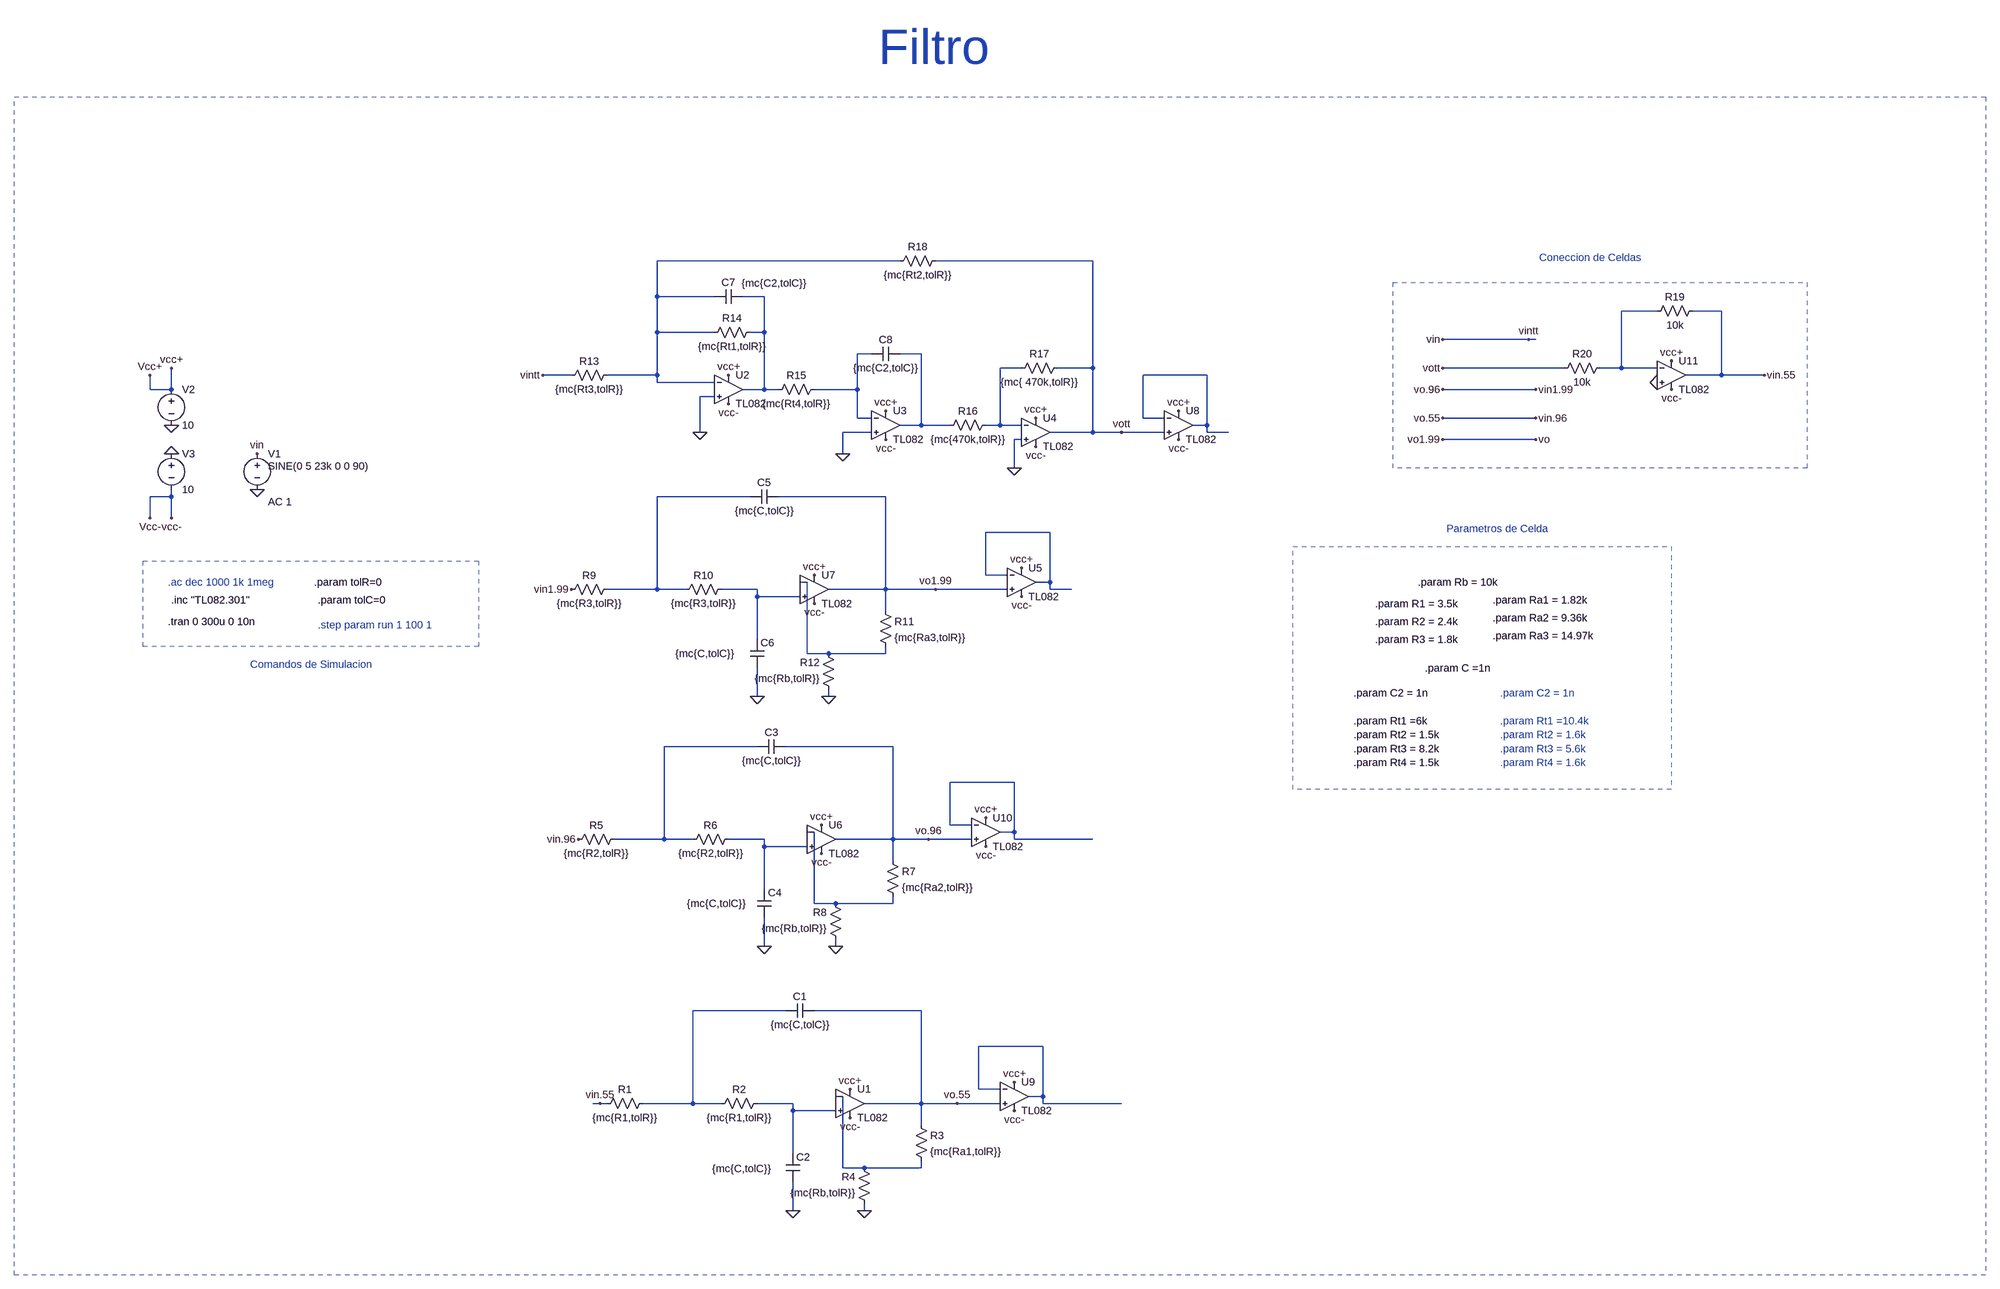
[diagram p0: schematic filterAux.asc]
filterAux.asc, the LTspice schematic file:
Version 4
SHEET 1 2724 1572
WIRE 288 -704 -256 -704
WIRE 720 -704 368 -704
WIRE -256 -624 -256 -704
WIRE -128 -624 -256 -624
WIRE -16 -624 -64 -624
WIRE 1984 -592 1904 -592
WIRE 2128 -592 2064 -592
WIRE -256 -544 -256 -624
WIRE -128 -544 -256 -544
WIRE -16 -544 -16 -624
WIRE -16 -544 -48 -544
WIRE 1696 -528 1504 -528
WIRE 1712 -528 1696 -528
WIRE 224 -496 192 -496
WIRE 336 -496 288 -496
WIRE 560 -464 512 -464
WIRE 720 -464 720 -704
WIRE 720 -464 640 -464
WIRE 1776 -464 1504 -464
WIRE 1904 -464 1904 -592
WIRE 1904 -464 1856 -464
WIRE 1984 -464 1904 -464
WIRE -448 -448 -512 -448
WIRE -256 -448 -256 -544
WIRE -256 -448 -368 -448
WIRE 976 -448 832 -448
WIRE 2128 -448 2128 -592
WIRE 2128 -448 2048 -448
WIRE 2224 -448 2128 -448
WIRE -256 -432 -256 -448
WIRE -128 -432 -256 -432
WIRE -1392 -416 -1392 -448
WIRE -1344 -416 -1344 -464
WIRE -1344 -416 -1392 -416
WIRE -16 -416 -16 -544
WIRE -16 -416 -64 -416
WIRE 16 -416 -16 -416
WIRE 192 -416 192 -496
WIRE 192 -416 96 -416
WIRE 1712 -416 1504 -416
WIRE -128 -400 -160 -400
WIRE 192 -352 192 -416
WIRE 224 -352 192 -352
WIRE 832 -352 832 -448
WIRE 880 -352 832 -352
WIRE 1712 -352 1504 -352
WIRE 336 -336 336 -496
WIRE 336 -336 288 -336
WIRE 400 -336 336 -336
WIRE 512 -336 512 -464
WIRE 512 -336 480 -336
WIRE 560 -336 512 -336
WIRE 976 -336 976 -448
WIRE 976 -336 944 -336
WIRE -160 -320 -160 -400
WIRE 224 -320 160 -320
WIRE 720 -320 720 -464
WIRE 720 -320 624 -320
WIRE 784 -320 720 -320
WIRE 880 -320 784 -320
WIRE 976 -320 976 -336
WIRE 1024 -320 976 -320
WIRE 560 -304 544 -304
WIRE 1712 -304 1504 -304
WIRE 160 -272 160 -320
WIRE 544 -240 544 -304
WIRE -1344 -176 -1344 -192
WIRE -1344 -176 -1392 -176
WIRE -48 -176 -256 -176
WIRE 256 -176 16 -176
WIRE -1392 -128 -1392 -176
WIRE -1344 -128 -1344 -176
WIRE 624 -96 480 -96
WIRE 480 0 480 -96
WIRE 528 0 480 0
WIRE 80 16 64 16
WIRE 624 16 624 -96
WIRE 624 16 592 16
WIRE -256 32 -256 -176
WIRE -256 32 -368 32
WIRE -192 32 -256 32
WIRE -32 32 -112 32
WIRE 256 32 256 -176
WIRE 256 32 128 32
WIRE 368 32 256 32
WIRE 528 32 368 32
WIRE 624 32 624 16
WIRE 672 32 624 32
WIRE -32 48 -32 32
WIRE 64 48 -32 48
WIRE 256 80 256 32
WIRE -32 144 -32 48
WIRE 80 176 80 16
WIRE 128 176 80 176
WIRE 256 176 256 160
WIRE 256 176 128 176
WIRE -32 272 -32 208
WIRE 128 272 128 256
WIRE -32 384 -240 384
WIRE 272 384 32 384
WIRE 544 464 400 464
WIRE 400 560 400 464
WIRE 448 560 400 560
WIRE 96 576 80 576
WIRE 544 576 544 464
WIRE 544 576 512 576
WIRE -240 592 -240 384
WIRE -240 592 -352 592
WIRE -176 592 -240 592
WIRE -16 592 -96 592
WIRE 272 592 272 384
WIRE 272 592 144 592
WIRE 352 592 272 592
WIRE 448 592 352 592
WIRE 544 592 544 576
WIRE 720 592 544 592
WIRE -16 608 -16 592
WIRE 80 608 -16 608
WIRE 272 640 272 592
WIRE -16 704 -16 608
WIRE 96 736 96 576
WIRE 144 736 96 736
WIRE 272 736 272 720
WIRE 272 736 144 736
WIRE -16 832 -16 768
WIRE 144 832 144 816
WIRE 32 976 -176 976
WIRE 336 976 96 976
WIRE 608 1056 464 1056
WIRE 464 1152 464 1056
WIRE 512 1152 464 1152
WIRE 160 1168 144 1168
WIRE 608 1168 608 1056
WIRE 608 1168 576 1168
WIRE -384 1184 -400 1184
WIRE -368 1184 -384 1184
WIRE -176 1184 -176 976
WIRE -176 1184 -288 1184
WIRE -112 1184 -176 1184
WIRE 48 1184 -32 1184
WIRE 336 1184 336 976
WIRE 336 1184 208 1184
WIRE 416 1184 336 1184
WIRE 512 1184 416 1184
WIRE 608 1184 608 1168
WIRE 784 1184 608 1184
WIRE 48 1200 48 1184
WIRE 144 1200 48 1200
WIRE 336 1232 336 1184
WIRE 48 1296 48 1200
WIRE 160 1328 160 1168
WIRE 208 1328 160 1328
WIRE 336 1328 336 1312
WIRE 336 1328 208 1328
WIRE 48 1424 48 1360
WIRE 208 1424 208 1408
FLAG -1152 -192 0
FLAG -1344 -336 0
FLAG -1344 -272 0
FLAG -1344 -464 vcc+
FLAG -1344 -128 vcc-
FLAG -1152 -272 vin
FLAG 48 1424 0
FLAG 208 1424 0
FLAG 176 1152 vcc+
FLAG 176 1216 vcc-
FLAG -16 832 0
FLAG 144 832 0
FLAG -32 272 0
FLAG 128 272 0
FLAG -96 -448 vcc+
FLAG -96 -384 vcc-
FLAG 256 -368 vcc+
FLAG 256 -304 vcc-
FLAG 592 -352 vcc+
FLAG 592 -288 vcc-
FLAG 368 32 vo1.99
FLAG -160 -320 0
FLAG 160 -272 0
FLAG 544 -240 0
FLAG 560 -16 vcc+
FLAG 560 48 vcc-
FLAG 112 560 vcc+
FLAG 112 624 vcc-
FLAG 96 0 vcc+
FLAG 96 64 vcc-
FLAG 912 -368 vcc+
FLAG 912 -304 vcc-
FLAG -512 -448 vintt
FLAG 544 1136 vcc+
FLAG 544 1200 vcc-
FLAG 480 544 vcc+
FLAG 480 608 vcc-
FLAG 784 -320 vott
FLAG -448 32 vin1.99
FLAG -432 592 vin.96
FLAG 352 592 vo.96
FLAG -384 1184 vin.55
FLAG 416 1184 vo.55
FLAG 1504 -528 vin
FLAG 1696 -528 vintt
FLAG 1504 -464 vott
FLAG 1712 -352 vin.96
FLAG 2224 -448 vin.55
FLAG 1504 -416 vo.96
FLAG 1712 -416 vin1.99
FLAG 1504 -352 vo.55
FLAG 1504 -304 vo1.99
FLAG 1712 -304 vo
FLAG 2016 -480 vcc+
FLAG 2016 -416 vcc-
FLAG 1984 -432 0
FLAG -1392 -448 Vcc+
FLAG -1392 -128 Vcc-
SYMBOL voltage -1152 -288 R0
WINDOW 123 24 124 Left 2
WINDOW 39 0 0 Left 2
WINDOW 3 24 44 Left 2
SYMATTR Value2 AC 1
SYMATTR Value SINE(0 5 23k 0 0 90)
SYMATTR InstName V1
SYMBOL voltage -1344 -432 R0
WINDOW 123 0 0 Left 0
WINDOW 39 0 0 Left 0
SYMATTR InstName V2
SYMATTR Value 10
SYMBOL voltage -1344 -288 R0
WINDOW 123 0 0 Left 0
WINDOW 39 0 0 Left 0
SYMATTR InstName V3
SYMATTR Value 10
SYMBOL res -272 1168 R90
WINDOW 0 0 56 VBottom 2
WINDOW 3 32 56 VTop 2
SYMATTR InstName R1
SYMATTR Value {mc{R1,tolR}}
SYMBOL res -16 1168 R90
WINDOW 0 0 56 VBottom 2
WINDOW 3 32 56 VTop 2
SYMATTR InstName R2
SYMATTR Value {mc{R1,tolR}}
SYMBOL Opamps\\opamp2 176 1120 R0
SYMATTR InstName U1
SYMATTR Value TL082
SYMBOL cap 96 960 R90
WINDOW 0 0 32 VBottom 2
WINDOW 3 32 32 VTop 2
SYMATTR InstName C1
SYMATTR Value {mc{C,tolC}}
SYMBOL cap 32 1296 R0
WINDOW 3 -165 34 Left 2
SYMATTR Value {mc{C,tolC}}
SYMATTR InstName C2
SYMBOL res 320 1216 R0
SYMATTR InstName R3
SYMATTR Value {mc{Ra1,tolR}}
SYMBOL res 224 1424 R180
WINDOW 0 36 76 Left 2
WINDOW 3 36 40 Left 2
SYMATTR InstName R4
SYMATTR Value {mc{Rb,tolR}}
SYMBOL res -336 576 R90
WINDOW 0 0 56 VBottom 2
WINDOW 3 32 56 VTop 2
SYMATTR InstName R5
SYMATTR Value {mc{R2,tolR}}
SYMBOL res -80 576 R90
WINDOW 0 0 56 VBottom 2
WINDOW 3 32 56 VTop 2
SYMATTR InstName R6
SYMATTR Value {mc{R2,tolR}}
SYMBOL cap 32 368 R90
WINDOW 0 0 32 VBottom 2
WINDOW 3 32 32 VTop 2
SYMATTR InstName C3
SYMATTR Value {mc{C,tolC}}
SYMBOL cap -32 704 R0
WINDOW 3 -157 32 Left 2
SYMATTR Value {mc{C,tolC}}
SYMATTR InstName C4
SYMBOL res 256 624 R0
SYMATTR InstName R7
SYMATTR Value {mc{Ra2,tolR}}
SYMBOL res 160 832 R180
WINDOW 0 36 76 Left 2
WINDOW 3 36 40 Left 2
SYMATTR InstName R8
SYMATTR Value {mc{Rb,tolR}}
SYMBOL res -352 16 R90
WINDOW 0 0 56 VBottom 2
WINDOW 3 32 56 VTop 2
SYMATTR InstName R9
SYMATTR Value {mc{R3,tolR}}
SYMBOL res -96 16 R90
WINDOW 0 0 56 VBottom 2
WINDOW 3 32 56 VTop 2
SYMATTR InstName R10
SYMATTR Value {mc{R3,tolR}}
SYMBOL cap 16 -192 R90
WINDOW 0 0 32 VBottom 2
WINDOW 3 32 32 VTop 2
SYMATTR InstName C5
SYMATTR Value {mc{C,tolC}}
SYMBOL cap -48 144 R0
WINDOW 3 -167 32 Left 2
SYMATTR Value {mc{C,tolC}}
SYMATTR InstName C6
SYMBOL res 240 64 R0
SYMATTR InstName R11
SYMATTR Value {mc{Ra3,tolR}}
SYMBOL res 144 272 R180
WINDOW 0 36 76 Left 2
WINDOW 3 36 40 Left 2
SYMATTR InstName R12
SYMATTR Value {mc{Rb,tolR}}
SYMBOL Opamps\\opamp2 -96 -480 R0
SYMATTR InstName U2
SYMATTR Value TL082
SYMBOL Opamps\\opamp2 256 -400 R0
SYMATTR InstName U3
SYMATTR Value TL082
SYMBOL Opamps\\opamp2 592 -384 R0
SYMATTR InstName U4
SYMATTR Value TL082
SYMBOL res -352 -464 R90
WINDOW 0 0 56 VBottom 2
WINDOW 3 32 56 VTop 2
SYMATTR InstName R13
SYMATTR Value {mc{Rt3,tolR}}
SYMBOL cap -64 -640 R90
WINDOW 0 0 32 VBottom 2
WINDOW 3 -30 -70 VTop 2
SYMATTR InstName C7
SYMATTR Value {mc{C2,tolC}}
SYMBOL cap 288 -512 R90
WINDOW 0 0 32 VBottom 2
WINDOW 3 32 32 VTop 2
SYMATTR InstName C8
SYMATTR Value {mc{C2,tolC}}
SYMBOL res -32 -560 R90
WINDOW 0 0 56 VBottom 2
WINDOW 3 32 56 VTop 2
SYMATTR InstName R14
SYMATTR Value {mc{Rt1,tolR}}
SYMBOL res 112 -432 R90
WINDOW 0 0 56 VBottom 2
WINDOW 3 32 56 VTop 2
SYMATTR InstName R15
SYMATTR Value {mc{Rt4,tolR}}
SYMBOL res 496 -352 R90
WINDOW 0 0 56 VBottom 2
WINDOW 3 32 56 VTop 2
SYMATTR InstName R16
SYMATTR Value {mc{470k,tolR}}
SYMBOL res 656 -480 R90
WINDOW 0 0 56 VBottom 2
WINDOW 3 32 56 VTop 2
SYMATTR InstName R17
SYMATTR Value {mc{ 470k,tolR}}
SYMBOL res 384 -720 R90
WINDOW 0 0 56 VBottom 2
WINDOW 3 32 56 VTop 2
SYMATTR InstName R18
SYMATTR Value {mc{Rt2,tolR}}
SYMBOL Opamps\\opamp2 560 -48 R0
SYMATTR InstName U5
SYMATTR Value TL082
SYMBOL Opamps\\opamp2 112 528 R0
SYMATTR InstName U6
SYMATTR Value TL082
SYMBOL Opamps\\opamp2 96 -32 R0
SYMATTR InstName U7
SYMATTR Value TL082
SYMBOL Opamps\\opamp2 912 -400 R0
SYMATTR InstName U8
SYMATTR Value TL082
SYMBOL Opamps\\opamp2 544 1104 R0
SYMATTR InstName U9
SYMATTR Value TL082
SYMBOL Opamps\\opamp2 480 512 R0
SYMATTR InstName U10
SYMATTR Value TL082
SYMBOL Opamps\\opamp2 2016 -512 R0
SYMATTR InstName U11
SYMATTR Value TL082
SYMBOL res 2080 -608 R90
WINDOW 0 0 56 VBottom 2
WINDOW 3 32 56 VTop 2
SYMATTR InstName R19
SYMATTR Value 10k
SYMBOL res 1872 -480 R90
WINDOW 0 0 56 VBottom 2
WINDOW 3 32 56 VTop 2
SYMATTR InstName R20
SYMATTR Value 10k
TEXT -1352 16 Left 2 ;.ac dec 1000 1k 1meg
TEXT -1344 56 Left 2 !.inc "TL082.301"
TEXT 1448 16 Left 2 !.param Rb = 10k
TEXT 1352 64 Left 2 !.param R1 = 3.5k
TEXT 1616 56 Left 2 !.param Ra1 = 1.82k
TEXT 1352 104 Left 2 !.param R2 = 2.4k
TEXT 1616 96 Left 2 !.param Ra2 = 9.36k
TEXT 1352 144 Left 2 !.param R3 = 1.8k
TEXT 1616 136 Left 2 !.param Ra3 = 14.97k
TEXT 1464 208 Left 2 !.param C =1n
TEXT -1024 16 Left 2 !.param tolR=0
TEXT -1016 56 Left 2 !.param tolC=0
TEXT -1016 112 Left 2 ;.step param run 1 100 1
TEXT 1632 264 Left 2 ;.param C2 = 1n\n \n.param Rt1 =10.4k\n.param Rt2 = 1.6k\n.param Rt3 = 5.6k\n.param Rt4 = 1.6k
TEXT -1352 104 Left 2 !.tran 0 300u 0 10n
TEXT 1304 264 Left 2 !.param C2 = 1n\n \n.param Rt1 =6k\n.param Rt2 = 1.5k\n.param Rt3 = 8.2k\n.param Rt4 = 1.5k
TEXT 1512 -104 Left 2 ;Parametros de Celda
TEXT -1168 200 Left 2 ;Comandos de Simulacion
TEXT 1720 -712 Left 2 ;Coneccion de Celdas
TEXT 240 -1184 Left 7 ;Filtro
RECTANGLE Normal 2720 1568 -1696 -1072 1
RECTANGLE Normal 2016 480 1168 -64 1
RECTANGLE Normal -656 160 -1408 -32 1
RECTANGLE Normal 2320 -240 1392 -656 1

The netlist it stands for:
* filterAux.asc
V1 vintt 0 SINE(0 5 23k 0 0 90) AC 1
V2 vcc+ 0 10
V3 0 vcc- 10
R1 N016 vin.55 {mc{R1,tolR}}
R2 N019 N016 {mc{R1,tolR}}
XU1 N019 N018 vcc+ vcc- vo.55 TL082  ; pins In+ In- V+ V- OUT
C1 vo.55 N016 {mc{C,tolC}}
C2 N019 0 {mc{C,tolC}}
R3 vo.55 N018 {mc{Ra1,tolR}}
R4 0 N018 {mc{Rb,tolR}}
R5 N012 vo.55 {mc{R2,tolR}}
R6 N015 N012 {mc{R2,tolR}}
C3 vo.96 N012 {mc{C,tolC}}
C4 N015 0 {mc{C,tolC}}
R7 vo.96 N014 {mc{Ra2,tolR}}
R8 0 N014 {mc{Rb,tolR}}
R9 N008 vo.96 {mc{R3,tolR}}
R10 N011 N008 {mc{R3,tolR}}
C5 vo N008 {mc{C,tolC}}
C6 N011 0 {mc{C,tolC}}
R11 vo N010 {mc{Ra3,tolR}}
R12 0 N010 {mc{Rb,tolR}}
XU2 0 N001 vcc+ vcc- N002 TL082  ; pins In+ In- V+ V- OUT
XU3 0 N004 vcc+ vcc- N005 TL082  ; pins In+ In- V+ V- OUT
XU4 0 N006 vcc+ vcc- vott TL082  ; pins In+ In- V+ V- OUT
R13 N001 vintt {mc{Rt3,tolR}}
C7 N002 N001 {mc{C2,tolC}}
C8 N005 N004 {mc{C2,tolC}}
R14 N002 N001 {mc{Rt1,tolR}}
R15 N004 N002 {mc{Rt4,tolR}}
R16 N006 N005 {mc{470k,tolR}}
R17 vott N006 {mc{ 470k,tolR}}
R18 vott N001 {mc{Rt2,tolR}}
XU5 vo N009 vcc+ vcc- N009 TL082  ; pins In+ In- V+ V- OUT
XU6 N015 N014 vcc+ vcc- vo.96 TL082  ; pins In+ In- V+ V- OUT
XU7 N011 N010 vcc+ vcc- vo TL082  ; pins In+ In- V+ V- OUT
XU8 vott N007 vcc+ vcc- N007 TL082  ; pins In+ In- V+ V- OUT
XU9 vo.55 N017 vcc+ vcc- N017 TL082  ; pins In+ In- V+ V- OUT
XU10 vo.96 N013 vcc+ vcc- N013 TL082  ; pins In+ In- V+ V- OUT
XU11 0 N003 vcc+ vcc- vin.55 TL082  ; pins In+ In- V+ V- OUT
R19 vin.55 N003 10k
R20 N003 vott 10k
* .ac dec 1000 1k 1meg
.inc "TL082.301"
.param Rb = 10k
.param R1 = 3.5k
.param Ra1 = 1.82k
.param R2 = 2.4k
.param Ra2 = 9.36k
.param R3 = 1.8k
.param Ra3 = 14.97k
.param C =1n
.param tolR=0
.param tolC=0
* .step param run 1 100 1
* .param C2 = 1n
* .param Rt1 =10.4k
* .param Rt2 = 1.6k
* .param Rt3 = 5.6k
* .param Rt4 = 1.6k
.tran 0 300u 0 10n
.param C2 = 1n
.param Rt1 =6k
.param Rt2 = 1.5k
.param Rt3 = 8.2k
.param Rt4 = 1.5k
* Parametros de Celda
* Comandos de Simulacion
* Coneccion de Celdas
* Filtro
.backanno
.end